# Altium project KPA_BDK2.PrjPcb
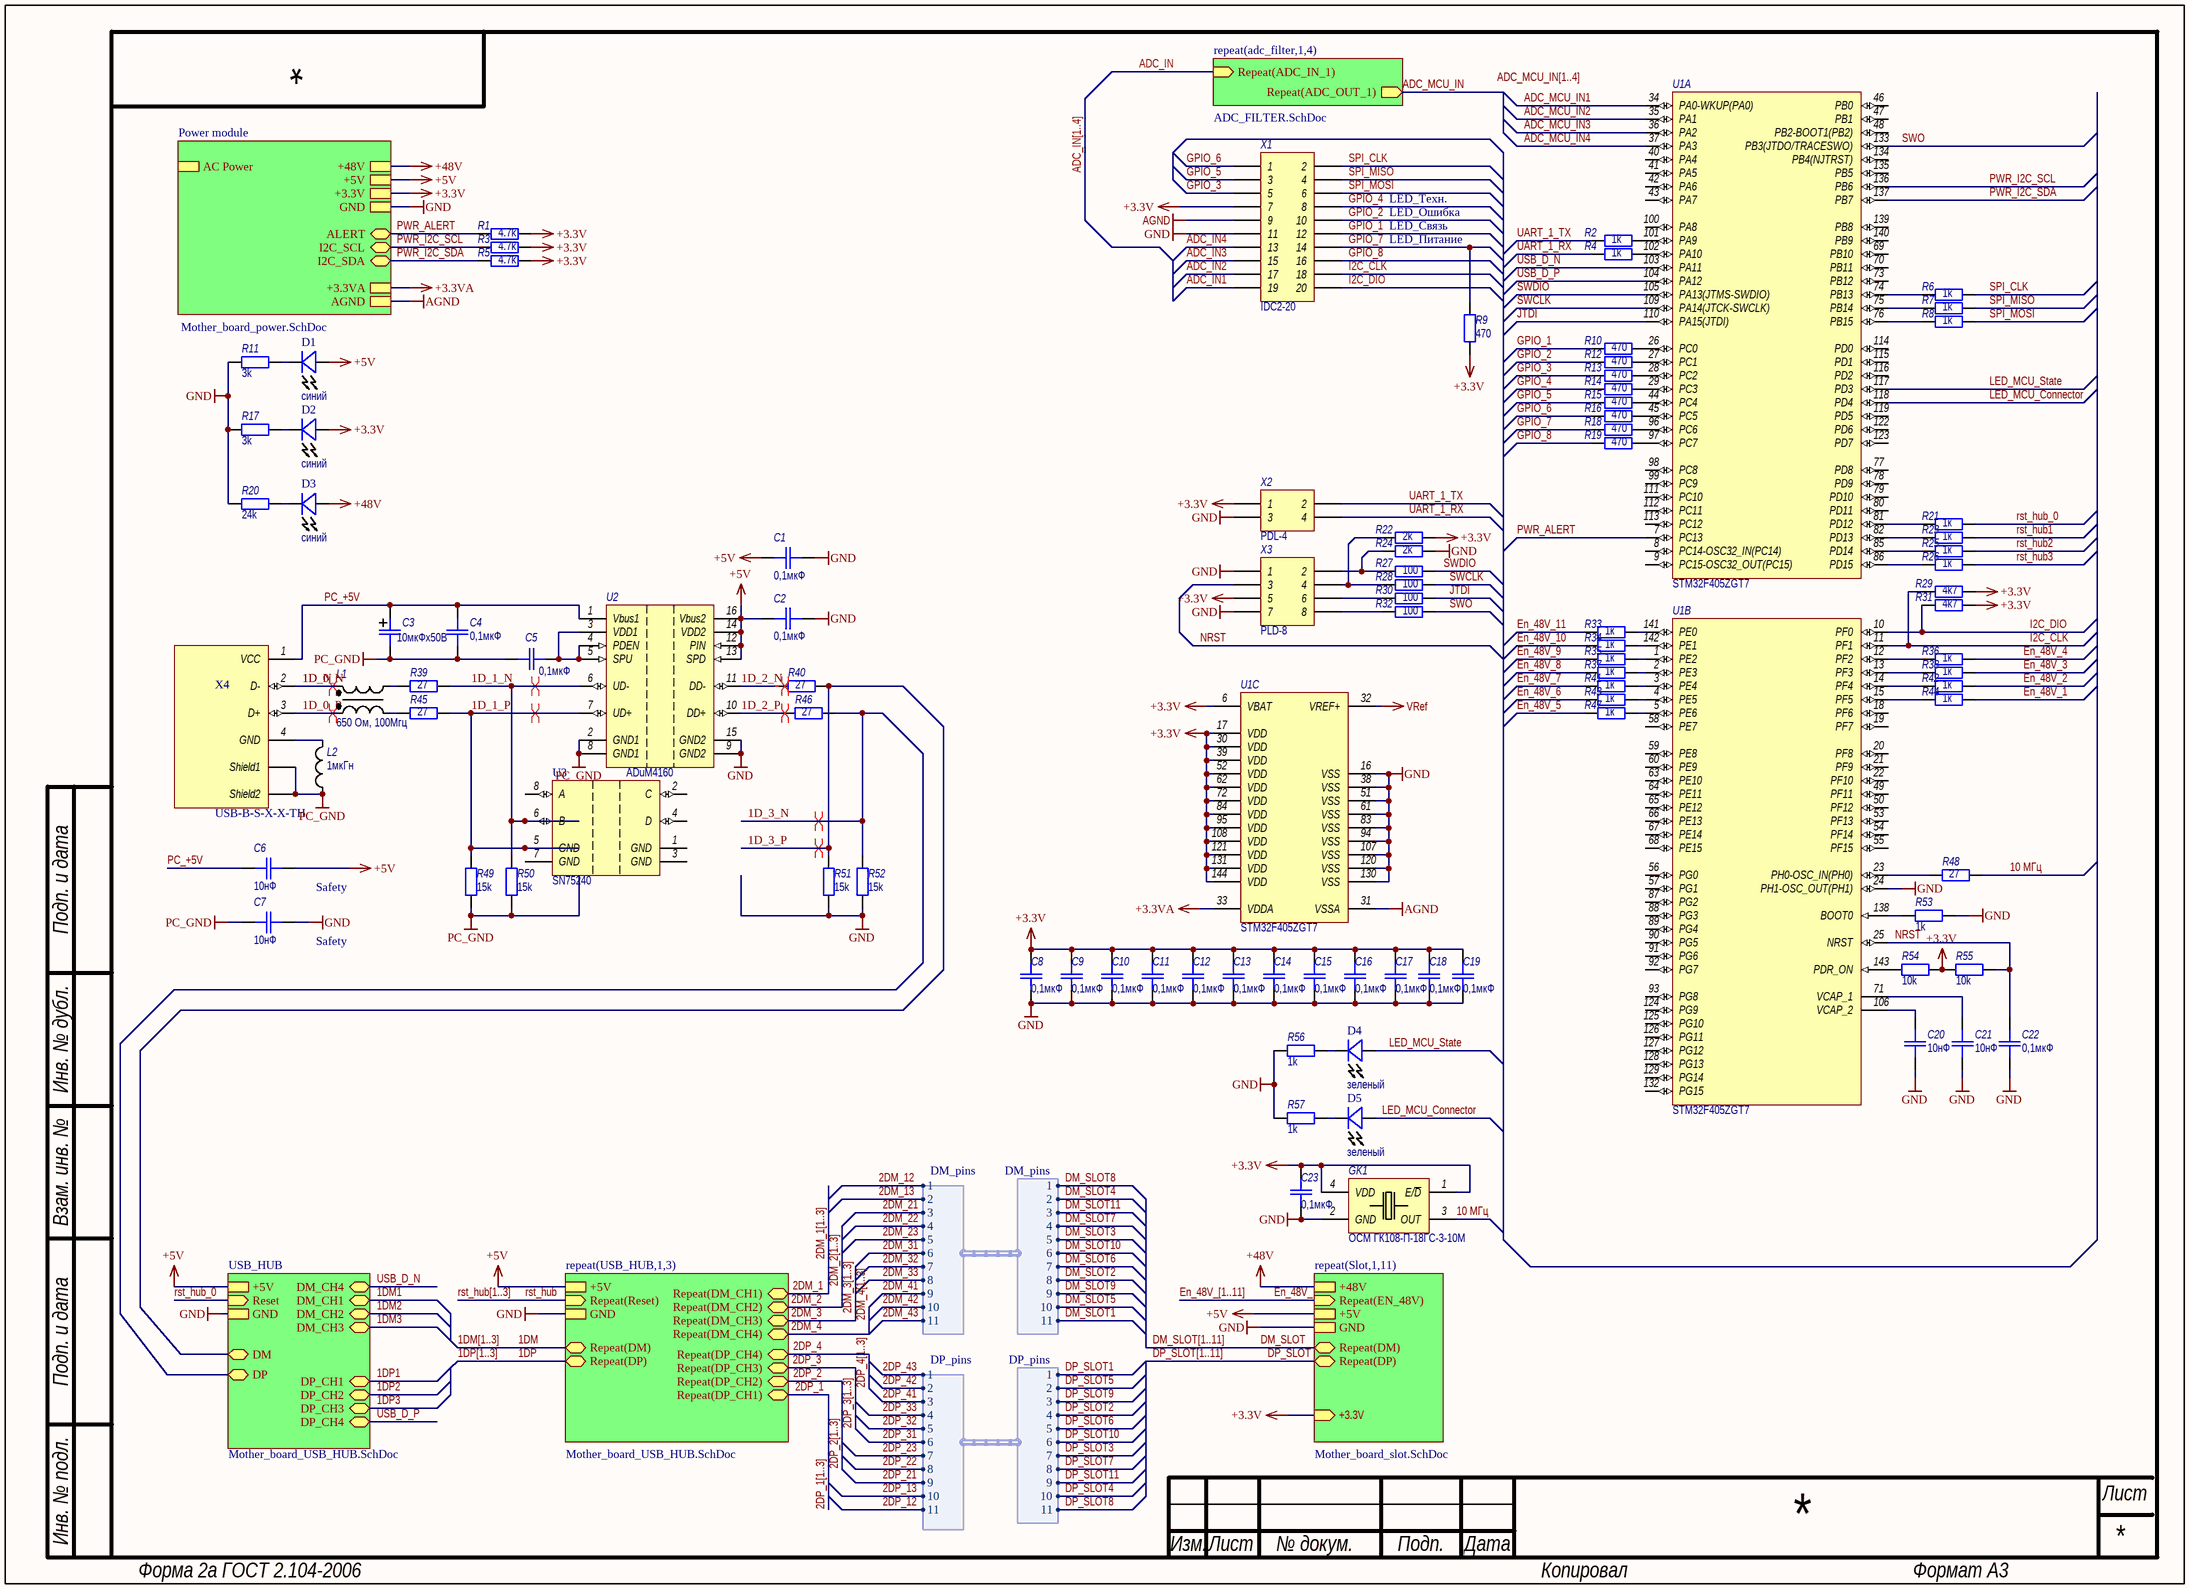
[diagram p0: Mother_board_main.SchDoc]
5 sheets, 354 parts. Net scope: hierarchical (ports join the sheet entries above them; power ports are global).
Board file: Mother_board.PcbDoc
Sheets:
  Mother_board_main.SchDoc
    Power module = Mother_board_power.SchDoc
    USB_HUB1 = Mother_board_USB_HUB.SchDoc
    USB_HUB2 = Mother_board_USB_HUB.SchDoc
    USB_HUB3 = Mother_board_USB_HUB.SchDoc
    Slot1 = Mother_board_slot.SchDoc
    Slot2 = Mother_board_slot.SchDoc
    Slot3 = Mother_board_slot.SchDoc
    Slot4 = Mother_board_slot.SchDoc
    Slot5 = Mother_board_slot.SchDoc
    Slot6 = Mother_board_slot.SchDoc
    Slot7 = Mother_board_slot.SchDoc
    Slot8 = Mother_board_slot.SchDoc
    Slot9 = Mother_board_slot.SchDoc
    Slot10 = Mother_board_slot.SchDoc
    Slot11 = Mother_board_slot.SchDoc
    USB_HUB = Mother_board_USB_HUB.SchDoc
    adc_filter1 = ADC_FILTER.SchDoc
    adc_filter2 = ADC_FILTER.SchDoc
    adc_filter3 = ADC_FILTER.SchDoc
    adc_filter4 = ADC_FILTER.SchDoc

## Sheet Mother_board_main.SchDoc
size 410 x 297 mm

### Parts
C1  0,1мкФ  [SMD_0805]
C2  0,1мкФ  [SMD_0805]
C3  10мкФх50В  [SMD_size_B]
C4  0,1мкФ  [SMD_0805]
C5  0,1мкФ  [SMD_0805]
C6  10нФ  [SMD_0805]
C7  10нФ  [SMD_0805]
C8  0,1мкФ  [SMD_0805]
C9  0,1мкФ  [SMD_0805]
C10  0,1мкФ  [SMD_0805]
C11  0,1мкФ  [SMD_0805]
C12  0,1мкФ  [SMD_0805]
C13  0,1мкФ  [SMD_0805]
C14  0,1мкФ  [SMD_0805]
C15  0,1мкФ  [SMD_0805]
C16  0,1мкФ  [SMD_0805]
C17  0,1мкФ  [SMD_0805]
C18  0,1мкФ  [SMD_0805]
C19  0,1мкФ  [SMD_0805]
C20  10нФ  [SMD_0805]
C21  10нФ  [SMD_0805]
C22  0,1мкФ  [SMD_0805]
C23  0,1мкФ  [SMD_0805]
D1  value синий  [LED-0805]  (hidden comment: LED)
D2  value синий  [LED-0805]  (hidden comment: LED)
D3  value синий  [LED-0805]  (hidden comment: LED)
D4  value зеленый  [LED-0805+circle]  (hidden comment: LED)
D5  value зеленый  [LED-0805+circle]  (hidden comment: LED)
GK1  Наименование: ОСМ ГК108-П-18ГС-3-10М  [SMD_7050_Crystal_Oscillator]  (hidden comment: GK108-P)
L1  650 Ом, 100Мгц  [ACM2012]
L2  1мкГн  [SMD_0805]
R1  4.7k  [SMD_0805]
R2  1k  [SMD_0805]
R3  4.7k  [SMD_0805]
R4  1k  [SMD_0805]
R5  4.7k  [SMD_0805]
R6  1k  [SMD_0805]
R7  1k  [SMD_0805]
R8  1k  [SMD_0805]
R9  470  [SMD_0805]
R10  470  [SMD_0805]
R11  3k  [SMD_0805]
R12  470  [SMD_0805]
R13  470  [SMD_0805]
R14  470  [SMD_0805]
R15  470  [SMD_0805]
R16  470  [SMD_0805]
R17  3k  [SMD_0805]
R18  470  [SMD_0805]
R19  470  [SMD_0805]
R20  24k  [SMD_0805]
R21  1к  [SMD_0805]
R22  2k  [SMD_0805]
R23  1к  [SMD_0805]
R24  2k  [SMD_0805]
R25  1к  [SMD_0805]
R26  1к  [SMD_0805]
R27  100  [SMD_0805]
R28  100  [SMD_0805]
R29  4k7  [SMD_0805]
R30  100  [SMD_0805]
R31  4k7  [SMD_0805]
R32  100  [SMD_0805]
R33  1к  [SMD_0805]
R34  1к  [SMD_0805]
R35  1к  [SMD_0805]
R36  1к  [SMD_0805]
R37  1к  [SMD_0805]
R38  1к  [SMD_0805]
R39  27  [SMD_0805]
R40  27  [SMD_0805]
R41  1к  [SMD_0805]
R42  1к  [SMD_0805]
R43  1к  [SMD_0805]
R44  1к  [SMD_0805]
R45  27  [SMD_0805]
R46  27  [SMD_0805]
R47  1к  [SMD_0805]
R48  27  [SMD_0805]
R49  15k  [SMD_0805]
R50  15k  [SMD_0805]
R51  15k  [SMD_0805]
R52  15k  [SMD_0805]
R53  1k  [SMD_0805]
R54  10k  [SMD_0805]
R55  10k  [SMD_0805]
R56  1k  [SMD_0805]
R57  1k  [SMD_0805]
U1  STM32F405ZGT7  [LQFP144]  (parts A,B,C of 3)
U2  ADuM1402  [SOIC-16-WIDE]  (value not drawn)
U3  SN75240  [SN75240]
X1  Наименование: IDC2-20  [PLD2-20]  (hidden comment: Header 2X20)
X2  Наименование: PDL-4  [PBD-4]  (hidden comment: Header 2X4)
X3  Наименование: PLD-8  [PBD-8]  (hidden comment: Header 2X8)
X4  USB-B-S-X-X-TH  [*SAMTEC_USB-B-S-X-X-TH_USB-B-S-X-X-TH(Primary)]

### Sub-sheets
Power module = Mother_board_power.SchDoc: AC Power (harness AC Power), I2C_SCL (bidir), I2C_SDA (bidir), ALERT (bidir), +5V, +48V, +3.3V, GND, +3.3VA, AGND
repeat(adc_filter,1,4) = ADC_FILTER.SchDoc: Repeat(ADC_OUT_1) (out), Repeat(ADC_IN_1) (in)
repeat(Slot,1,11) = Mother_board_slot.SchDoc: Repeat(DM) (bidir), Repeat(EN_48V) (in), Repeat(DP) (bidir), +48V, +5V, GND, +3.3V (in)
repeat(USB_HUB,1,3) = Mother_board_USB_HUB.SchDoc: Repeat(Reset) (in), Repeat(DP) (bidir), Repeat(DM) (bidir), Repeat(DP_CH1) (bidir), Repeat(DP_CH2) (bidir), Repeat(DP_CH3) (bidir), Repeat(DP_CH4) (bidir), Repeat(DM_CH1) (bidir), Repeat(DM_CH2) (bidir), Repeat(DM_CH3) (bidir), Repeat(DM_CH4) (bidir), +5V, GND
USB_HUB = Mother_board_USB_HUB.SchDoc: Reset (in), DP (bidir), DM (bidir), DP_CH1 (bidir), DP_CH2 (bidir), DP_CH3 (bidir), DP_CH4 (bidir), DM_CH1 (bidir), DM_CH2 (bidir), DM_CH3 (bidir), DM_CH4 (bidir), GND, +5V

### Harnesses
DM_pins: 1, 2, 3, 4, 5, 6, 7, 8, 9, 10, 11
DP_pins: 1, 2, 3, 4, 5, 6, 7, 8, 9, 10, 11

### Nets
+3.3V: C8.2 C9.2 C10.2 C11.2 C12.2 C13.2 C14.2 C15.2 C16.2 C17.2 C18.2 C19.2 C23.2 D2.1(A) GK1.1(E/~{D}) GK1.4(VDD) R1.1 R3.1 R5.1 R9.1 R22.2 R29.2 R31.2 R54.1 R55.2 U1.6(VBAT) U1.17(VDD) U1.30(VDD) U1.39(VDD) U1.52(VDD) U1.62(VDD) U1.72(VDD) U1.84(VDD) U1.95(VDD) U1.108(VDD) U1.121(VDD) U1.131(VDD) U1.144(VDD) X1.7 X2.1 X3.5 ; sheet Power module/+3.3V, sheet repeat(Slot,1,11)/+3.3V
+3.3VA: U1.33(VDDA) ; sheet Power module/+3.3VA
+5V: C1.2 C2.2 C6.2 D1.1(A) U2.12(PIN) U2.13(SPD) U2.14(VDD2) U2.16(Vbus2) ; sheet Power module/+5V, sheet repeat(USB_HUB,1,3)/+5V, sheet repeat(Slot,1,11)/+5V, sheet USB_HUB/+5V
+48V: D3.1(A) ; sheet Power module/+48V, sheet repeat(Slot,1,11)/+48V
AGND: U1.31(VSSA) X1.9 ; sheet Power module/AGND
GND: C1.1 C2.1 C7.2 C8.1 C9.1 C10.1 C11.1 C12.1 C13.1 C14.1 C15.1 C16.1 C17.1 C18.1 C19.1 C20.1 C21.1 C22.1 C23.1 GK1.2(GND) R11.1 R17.1 R20.1 R24.2 R51.2 R52.2 R53.1 R56.1 R57.1 U1.16(VSS) U1.24(PH1-OSC_OUT(PH1)) U1.38(VSS) U1.51(VSS) U1.61(VSS) U1.83(VSS) U1.94(VSS) U1.107(VSS) U1.120(VSS) U1.130(VSS) U2.9(GND2) U2.15(GND2) X1.11 X2.3 X3.1 X3.7 ; sheet Power module/GND, sheet repeat(USB_HUB,1,3)/GND, sheet repeat(Slot,1,11)/GND, sheet USB_HUB/GND
PC_GND: C3.2 C4.2 C5.1 C7.1 L2.1 R49.1 R50.1 U2.2(GND1) U2.8(GND1) X4.S1(Shield1) X4.S2(Shield2)
VRef: U1.32(VREF+)
1D_0_N: L1.2 X4.2(D-)  [also labelled 1D_N]
1D_0_P: L1.3 X4.3(D+)
1D_1_N: R39.2 R50.2 U2.6(UD-) U3.6(B)
1D_1_P: R45.2 R49.2 U2.7(UD+) U3.5(GND)
1D_2_N: R40.1 U2.11(DD-)
1D_2_P: R46.1 U2.10(DD+)
1D_3_N: R46.2 R52.1 ; sheet USB_HUB/DP
1D_3_P: R40.2 R51.1 ; sheet USB_HUB/DM
1DM: sheet repeat(USB_HUB,1,3)/Repeat(DM)
1DM3: sheet USB_HUB/DP_CH3, sheet USB_HUB/DM_CH3  [also labelled 1DP3]
1DP: sheet repeat(USB_HUB,1,3)/Repeat(DP)
2DM_1: sheet repeat(USB_HUB,1,3)/Repeat(DM_CH1)
2DM_2: sheet repeat(USB_HUB,1,3)/Repeat(DM_CH2)
2DM_3: sheet repeat(USB_HUB,1,3)/Repeat(DM_CH3)
2DM_4: sheet repeat(USB_HUB,1,3)/Repeat(DM_CH4)
2DM_31: harness DM_pins.6, harness DP_pins.6  [also labelled 2DP_31, DM_SLOT10, DP_SLOT10]  [project net 2D_8_N]
2DM_32: harness DM_pins.7, harness DP_pins.5  [also labelled 2DP_32, DM_SLOT6, DP_SLOT6]  [project net 2D_8_N]
2DM_33: harness DM_pins.8, harness DP_pins.4  [also labelled 2DP_33, DM_SLOT2, DP_SLOT2]  [project net 2D_8_N]
2DP_1: sheet repeat(USB_HUB,1,3)/Repeat(DP_CH1)
2DP_2: sheet repeat(USB_HUB,1,3)/Repeat(DP_CH2)
2DP_3: sheet repeat(USB_HUB,1,3)/Repeat(DP_CH3)
2DP_4: sheet repeat(USB_HUB,1,3)/Repeat(DP_CH4)
10 МГц: GK1.3(OUT) R48.1
ADC_IN: sheet repeat(adc_filter,1,4)/Repeat(ADC_IN_1)
ADC_IN1: X1.19
ADC_IN2: X1.17
ADC_IN3: X1.15
ADC_IN4: X1.13
ADC_MCU_IN: sheet repeat(adc_filter,1,4)/Repeat(ADC_OUT_1)
ADC_MCU_IN1: U1.34(PA0-WKUP(PA0))
ADC_MCU_IN2: U1.35(PA1)
ADC_MCU_IN3: U1.36(PA2)
ADC_MCU_IN4: U1.37(PA3)
DM_SLOT: sheet repeat(Slot,1,11)/Repeat(DM)
DP_SLOT: sheet repeat(Slot,1,11)/Repeat(DP)
En_48V_: sheet repeat(Slot,1,11)/Repeat(EN_48V)  [also labelled En_48V_[1..11]]
En_48V_1: R44.1  [also labelled En_48V_[1..11]1]
En_48V_2: R42.1  [also labelled En_48V_[1..11]2]
En_48V_3: R38.1  [also labelled En_48V_[1..11]3]
En_48V_4: R36.1  [also labelled En_48V_[1..11]4]
En_48V_5: R47.2  [also labelled En_48V_[1..11]5]
En_48V_6: R43.2  [also labelled En_48V_[1..11]6]
En_48V_7: R41.2  [also labelled En_48V_[1..11]7]
En_48V_8: R37.2  [also labelled En_48V_[1..11]8]
En_48V_9: R35.2  [also labelled En_48V_[1..11]9]
En_48V_10: R34.2  [also labelled En_48V_[1..11]10]
En_48V_11: R33.2  [also labelled En_48V_[1..11]11]
GPIO_1: R10.1 X1.12
GPIO_2: R12.1 X1.10
GPIO_3: R13.1 X1.5
GPIO_4: R14.1 X1.8
GPIO_5: R15.1 X1.3
GPIO_6: R16.1 X1.1
GPIO_7: R9.2 R18.1 X1.14
GPIO_8: R19.1 X1.16
I2C_CLK: R29.1 U1.11(PF1) X1.18
I2C_DIO: R31.1 U1.10(PF0) X1.20
JTDI: R30.2 U1.110(PA15(JTDI))
LED_MCU_Connector: D5.1(A) U1.118(PD4)
LED_MCU_State: D4.1(A) U1.117(PD3)
NRST: C22.2 R55.1 U1.25(NRST) X3.3
PC_+5V: C3.1 C4.1 C6.1 U2.1(Vbus1) X4.1(VCC)
PWR_ALERT: R1.2 U1.7(PC13) ; sheet Power module/ALERT
PWR_I2C_SCL: R3.2 U1.136(PB6) ; sheet Power module/I2C_SCL  [project net I2C_SCL]
PWR_I2C_SDA: R5.2 U1.137(PB7) ; sheet Power module/I2C_SDA  [project net I2C_SDA]
rst_hub: sheet repeat(USB_HUB,1,3)/Repeat(Reset)
rst_hub1: R23.1
rst_hub2: R25.1
rst_hub3: R26.1
rst_hub_0: R21.1 ; sheet USB_HUB/Reset
SPI_CLK: R6.2 X1.2
SPI_MISO: R7.2 X1.4
SPI_MOSI: R8.2 X1.6
SWCLK: R28.2 U1.109(PA14(JTCK-SWCLK))
SWDIO: R27.2 U1.105(PA13(JTMS-SWDIO))
SWO: R32.2 U1.133(PB3(JTDO/TRACESWO))
UART_1_RX: R4.1 X2.4
UART_1_TX: R2.1 X2.2
USB_D_N: U1.103(PA11) ; sheet USB_HUB/DM_CH4  [project net 2D_9_N]
USB_D_P: U1.104(PA12) ; sheet USB_HUB/DP_CH4  [project net 2D_9_P]
NetC5_2: C5.2 U2.3(VDD1) U2.4(PDEN) U2.5(SPU)
NetC20_2: C20.2 U1.106(VCAP_2)
NetC21_2: C21.2 U1.71(VCAP_1)
NetD1_2: D1.2(K) R11.2
NetD2_2: D2.2(K) R17.2
NetD3_2: D3.2(K) R20.2
NetD4_2: D4.2(K) R56.2
NetD5_2: D5.2(K) R57.2
NetL1_1: L1.1 R39.1
NetL1_4: L1.4 R45.1
NetL2_2: L2.2 X4.4(GND)
NetR2_2: R2.2 U1.101(PA9)
NetR4_2: R4.2 U1.102(PA10)
NetR6_1: R6.1 U1.74(PB13)
NetR7_1: R7.1 U1.75(PB14)
NetR8_1: R8.1 U1.76(PB15)
NetR10_2: R10.2 U1.26(PC0)
NetR12_2: R12.2 U1.27(PC1)
NetR13_2: R13.2 U1.28(PC2)
NetR14_2: R14.2 U1.29(PC3)
NetR15_2: R15.2 U1.44(PC4)
NetR16_2: R16.2 U1.45(PC5)
NetR18_2: R18.2 U1.96(PC6)
NetR19_2: R19.2 U1.97(PC7)
NetR21_2: R21.2 U1.81(PD12)
NetR22_1: R22.1 R28.1 X3.4
NetR23_2: R23.2 U1.82(PD13)
NetR24_1: R24.1 R27.1 X3.2
NetR25_2: R25.2 U1.85(PD14)
NetR26_2: R26.2 U1.86(PD15)
NetR30_1: R30.1 X3.6
NetR32_1: R32.1 X3.8
NetR33_1: R33.1 U1.141(PE0)
NetR34_1: R34.1 U1.142(PE1)
NetR35_1: R35.1 U1.1(PE2)
NetR36_2: R36.2 U1.12(PF2)
NetR37_1: R37.1 U1.2(PE3)
NetR38_2: R38.2 U1.13(PF3)
NetR41_1: R41.1 U1.3(PE4)
NetR42_2: R42.2 U1.14(PF4)
NetR43_1: R43.1 U1.4(PE5)
NetR44_2: R44.2 U1.15(PF5)
NetR47_1: R47.1 U1.5(PE6)
NetR48_2: R48.2 U1.23(PH0-OSC_IN(PH0))
NetR53_2: R53.2 U1.138(BOOT0)
NetR54_2: R54.2 U1.143(PDR_ON)

Not connected (* = marked no-connect by the designer): U1 8(PC14-OSC32_IN(PC14)) 9(PC15-OSC32_OUT(PC15)) 18(PF6) 19(PF7) 20(PF8) 21(PF9) 22(PF10) 40(PA4) 41(PA5) 42(PA6) 43(PA7) 46(PB0) 47(PB1) 48(PB2-BOOT1(PB2)) 49(PF11) 50(PF12) 53(PF13) 54(PF14) 55(PF15) 56(PG0) 57(PG1) 58(PE7) 59(PE8) 60(PE9) 63(PE10) 64(PE11) 65(PE12) 66(PE13) 67(PE14) 68(PE15) 69(PB10) 70(PB11) 73(PB12) 77(PD8) 78(PD9) 79(PD10) 80(PD11) 87(PG2) 88(PG3) 89(PG4) 90(PG5) 91(PG6) 92(PG7) 93(PG8) 98(PC8) 99(PC9) 100(PA8) 111(PC10) 112(PC11) 113(PC12) 114(PD0) 115(PD1) 116(PD2) 119(PD5) 122(PD6) 123(PD7) 124(PG9) 125(PG10) 126(PG11) 127(PG12) 128(PG13) 129(PG14) 132(PG15) 134(PB4(NJTRST)) 135(PB5) 139(PB8) 140(PB9); U3 1(GND) 2(C) 3(GND) 4(D) 7(GND) 8(A)

### Buses and harness runs
bus 1DM[1..3]
bus 1DP[1..3]
bus 2DM_1[1..3]
bus 2DM_2[1..3]
bus 2DM_3[1..3]
bus 2DM_4[1..3]
bus 2DP_1[1..3]
bus 2DP_2[1..3]
bus 2DP_3[1..3]
bus 2DP_4[1..3]
bus ADC_IN[1..4]
bus ADC_MCU_IN[1..4]
bus DM_SLOT[1..11]
bus DP_SLOT[1..11]
bus rst_hub[1..3]

### Layout directives
differential pair: 1D_0_N, 1D_0_P, 1D_1_N, 1D_1_P, 1D_2_N, 1D_2_P, 1D_3_N, 1D_3_P

### Notes on the sheet
- LED_Питание
- LED_Техн.
- LED_Связь
- LED_Ошибка
- Safety
- (near C7) Safety
- Labels drawn without touching a wire or pin: ADC_MCU_IN[1..4]
- Подп. и дата
- Инв. № дубл.
- Взам. инв. №
- Инв. № подл.
- Изм.
- Лист
- № докум.
- Подп.
- Дата
- Форма 2а ГОСТ 2.104-2006
- Копировал
- Формат А3

### Library data of the parts
C1 C2 C4-C23 = Capacitor: Назначение: SMD-конденсатор; Наименование: Конденсатор; Потребление, Вт: 0
  C1 C2 C4 C5 C8-C19 C22 C23: Value: 0,1мкФ
  C6 C7 C20 C21: Value: 10нФ
C3 = Capacitor_pol: Polarized capacitor; Назначение: Поляризованный SMD-конденсатор; Наименование: Поляризованный конденсатор; Потребление, Вт: 0; Value: 10мкФх50В
D1-D5 = LED: Назначение: Светодиод; Наименование: SMD-LED; Потребление, Вт: 0,01
GK1 = Crystal_Oscillator: Crystall oscillator, CMOS, 3.3V, SMD7050; Назначение: Кварцевый генератор; Потребление, Вт: 0,165; ComponentLink1Description: DataSheet; ComponentLink1URL: http://www.lit-phonon.ru/downloads/GK108-P.pdf
L1 = Inductor_coupled: Coupled inductor; Назначение: Связанная индуктивность; Наименование: PLT10HH1026R0PN; Потребление, Вт: 0,1; Value: 650 Ом, 100Мгц
L2 = Inductor: Наименование: Индуктивность; Назначение: SMD-индуктивность; Потребление, Вт: 0,010; Value: 1мкГн
R1-R57 = Resistor: Наименование: Резистор; Назначение: SMD-резистор; Потребление, Вт: 0,001
  R1 R3 R5: Value: 4.7k
  R2 R4 R6-R8 R53 R56 R57: Value: 1k
  R9 R10 R12-R16 R18 R19: Value: 470
  R11 R17: Value: 3k
  R20: Value: 24k
  R21 R23 R25 R26 R33-R38 R41-R44 R47: Value: 1к
  R22 R24: Value: 2k
  R27 R28 R30 R32: Value: 100
  R29 R31: Value: 4k7
  R39 R40 R45 R46 R48: Value: 27
  R49-R52: Value: 15k
  R54 R55: Value: 10k
U1 = STM32F405ZGT: ARM Cortex-M4 32-bit MCU+FPU, 210 DMIPS, 1024 kB Flash, 192 kB Internal RAM, 114 I/Os, 144-pin LQFP, -40 to 105 degC, Tray; Потребление, Вт: 0.2; Назначение: ARM Cortex-M4 32-bit MCU+FPU; ComponentLink1Description: Datasheet; ComponentLink1URL: http://www.st.com/st-web-ui/static/active/en/resource/technical/document/datasheet/DM00037051.pdf; DataSheet: https://www.st.com/content/ccc/resource/technical/document/reference_manual/3d/6d/5a/66/b4/99/40/d4/DM00031020.pdf/files/DM00031020.pdf/jcr:content/translations/en.DM00031020.pdf; HalManual: https://www.st.com/resource/en/user_manual/dm00105879-description-of-stm32f4-hal-and-ll-drivers-stmicroelectronics.pdf; Наименование: STM32F405ZGT7
U2 = ADuM4160: Quad Channel Digital Isolator, 2.5 KV rms Insulation Rating; Назначение: цифровой изолятор шины USB; Потребление, Вт: 0,025; DataSheet: https://www.analog.com/media/en/technical-documentation/data-sheets/ADuM4160.pdf; UserGuide: https://www.analog.com/media/en/reference-design-documentation/reference-designs/CN0160.pdf; Наименование: ADuM4160
U3 = SN75240: ESD-защита; Потребление, Вт: 0; Назначение: ESD-защита; Наименование: SN75240
X1 = Header 2X20: Header, 20-Pin, Dual row; Потребление, Вт: 0,0; Назначение: Header, 20-Pin, Dual row
X2 = Header 2X4: Header, 4-Pin, Dual row; Потребление, Вт: 0,0; Назначение: Header, 4-Pin, Dual row
X3 = Header 2X8: Header, 8-Pin, Dual row; Потребление, Вт: 0,0; Назначение: Header, 8-Pin, Dual row
X4 = USB-B-S-X-X-TH: USB-B (USB TYPE-B) USB 2.0 Receptacle Connector 4 Position Through Hole, Right Angle; MP: USB-B-S-F-B-TH; Потребление, Вт: 0; Назначение: USB соединитель; Availability: Bad; BuyPart: https://www.snapeda.com/parts/USB-B-S-F-B-TH/Samtec%20Inc./view-part/226211/?ref=eda; Toby_UK-Purchase-URL: https://snapeda.com/shop?store=Toby+UK&id=226211; SnapEDA_Link: https://www.snapeda.com/parts/USB-B-S-F-B-TH/Samtec%20Inc./view-part/226211/?ref=snap; Value: *; Наименование: USB-B

## Sheet Mother_board_power.SchDoc
size 209 x 297 mm; PageSetup: Record=PageOptions|CenterHorizontal=True|CenterVertical=True|PrintScale=1.00|XCorrection=1.00|YCorrection=1.00|PrintKind=1|BorderSize=5000000|LeftOffset=0|BottomOffset=0|Orientation=2|PaperLength=1000|PaperWidth=1000|Scale=100|PaperSource=15|PrintQuality=1200|MediaType=1|DitherType=10|PaperKind=A3|PrintScaleMode=1; Weight: -; ScaleFactor: -; NormInspection: Норм.Контр.
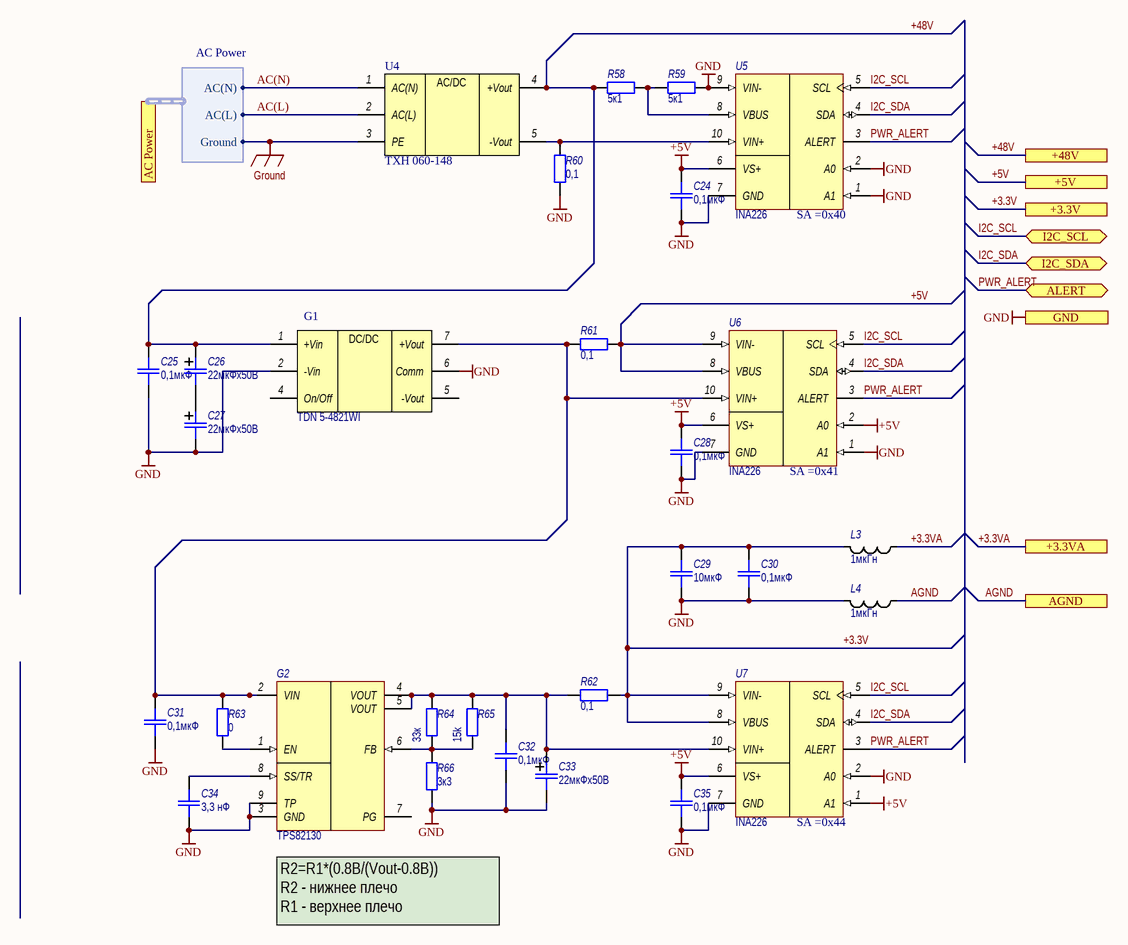
[diagram p1: Mother_board_power.SchDoc]

### Parts
C24  0,1мкФ  [SMD_0805]
C25  0,1мкФ  [SMD_0805]
C26  22мкФх50В  [SMD_size_B]
C27  22мкФх50В  [SMD_size_B]
C28  0,1мкФ  [SMD_0805]
C29  10мкФ  [SMD_0805]
C30  0,1мкФ  [SMD_0805]
C31  0,1мкФ  [SMD_0805]
C32  0,1мкФ  [SMD_0805]
C33  22мкФх50В  [SMD_size_B]
C34  3,3 нФ  [SMD_0805]
C35  0,1мкФ  [SMD_0805]
G1  Наименование: TDN 5-4821WI  [TDN_5_WISM]  (hidden comment: TDN 5-4821)
G2  TPS82130  [uSiL-8]
L3  1мкГн  [SMD_0805]
L4  1мкГн  [SMD_0805]
R58  5к1  [SMD_0805]
R59  5к1  [SMD_0805]
R60  0,1  [SMD_0805]
R61  0,1  [SMD_0805]
R62  0,1  [SMD_0805]
R63  0  [SMD_0805]
R64  33к  [SMD_0805]
R65  15k  [SMD_0805]
R66  3к3  [SMD_0805]
U4  TXH 060-148  [TXH 060-148 (2)]
U5  Adress: SA =0x40  [VSSOP-10]  (hidden comment: INA226)
U6  Adress: SA =0x41  [VSSOP-10]  (hidden comment: INA226)
U7  Adress: SA =0x44  [VSSOP-10]  (hidden comment: INA226)

### Ports
+3.3V, +3.3VA, +5V, +48V, AC Power (harness AC Power), AGND, ALERT (bidir), GND, I2C_SCL (bidir), I2C_SDA (bidir)

### Harnesses
AC Power: AC(N), AC(L), Ground

### Nets
+3.3V: C29.2 C30.2 L3.2 R62.2 U7.8(VBUS) U7.9(VIN-) ; port +3.3V
+3.3VA: L3.1 ; port +3.3VA
+5V: C24.2 C28.2 C35.2 R61.2 U5.6(VS+) U6.2(A0) U6.6(VS+) U6.8(VBUS) U6.9(VIN-) U7.1(A1) U7.6(VS+) ; port +5V
+48V: C25.2 C26.1 G1.1(+Vin) R58.1 U4.4(+Vout) ; port +48V
AGND: L4.1 ; port AGND
GND: C24.1 C25.1 C27.2 C28.1 C29.1 C30.1 C31.1 C32.1 C33.2 C34.1 C35.1 G1.2(-Vin) G1.6(Comm) G2.3(GND) G2.9(TP) L4.2 R59.2 R60.1 R66.2 U5.1(A1) U5.2(A0) U5.7(GND) U5.9(VIN-) U6.1(A1) U6.7(GND) U7.2(A0) U7.7(GND) ; port GND
Ground: U4.3(PE) ; port AC Power.Ground
AC(L): U4.2(AC(L)) ; port AC Power.AC(L)
AC(N): U4.1(AC(N)) ; port AC Power.AC(N)
I2C_SCL: U5.5(SCL) U6.5(SCL) U7.5(SCL) ; port I2C_SCL
I2C_SDA: U5.4(SDA) U6.4(SDA) U7.4(SDA) ; port I2C_SDA
PWR_ALERT: U5.3(ALERT) U6.3(ALERT) U7.3(ALERT) ; port ALERT
NetC26_2: C26.2 C27.1
NetC31_2: C31.2 G1.7(+Vout) G2.2(VIN) R61.1 R63.2 U6.10(VIN+)
NetC32_2: C32.2 C33.1 G2.4(VOUT) G2.5(VOUT) R62.1 R64.1 R65.1 U7.10(VIN+)
NetC34_2: C34.2 G2.8(SS/TR)
NetG2_1: G2.1(EN) R63.1
NetG2_6: G2.6(FB) R64.2 R65.2 R66.1
NetR58_2: R58.2 R59.1 U5.8(VBUS)
NetR60_2: R60.2 U4.5(-Vout) U5.10(VIN+)

Not connected (* = marked no-connect by the designer): G1 4(On/Off) 5(-Vout); G2 7(PG)

### Notes on the sheet
- (near G2) R2=R1*(0.8В/(Vout-0.8B))
  R2 - нижнее плечо
  R1 - верхнее плечо
- Перв. примен.
- Справ. №
- Подп. и дата
- Инв. № дубл.
- Взам. инв. №
- Разраб.
- Изм.
- Лист
- № докум.
- Подп.
- Дата
- Литера
- Масса
- Масштаб
- Пров.
- Т.контр.
- Листов
- Инв. № подл.
- Н.контр.
- Утв.
- Форма 1 ГОСТ 2.104-2006
- Копировал
- Формат А4
- (in symbol TEN5 2411) DC/DC
- (in symbol TXH 060-148) AC/DC

### Library data of the parts
C24 C25 C28-C32 C34 C35 = Capacitor: as C1 on sheet Mother_board_main
  C24 C25 C28 C30-C32 C35: Value: 0,1мкФ
  C29: Value: 10мкФ
  C34: Value: 3,3 нФ
C26 C27 C33 = Capacitor_pol: as C3 on sheet Mother_board_main; Value: 22мкФх50В
G1 = TEN5 2411: DC/DC converter; Назначение: DC-DC преобразователь; Потребление, Вт: 0,01; DataSheet: https://www.tracopower.com/sites/default/files/products/datasheets/tdn5wi_datasheet.pdf
G2 = TPS82130: 17-V Input 3-A Step-Down Converter MicroSiP™ Module with Integrated Inductor; Потребление, Вт: 1,0; ComponentLink1Description: Data sheet; ComponentLink1URL: http://www.ti.com/lit/ds/symlink/tps82130.pdf; Назначение: 17-V Input 3-A Step-Down Converter MicroSiP™ Module with Integrated Inductor; DataSheet: https://www.ti.com/lit/ds/symlink/tps82130.pdf?ts=1592813288219&ref_url=https%253A%252F%252Fwww.google.com%252F; Наименование: TPS82130
L3 L4 = Inductor: as L2 on sheet Mother_board_main; Value: 1мкГн
R58-R66 = Resistor: as R1 on sheet Mother_board_main
  R58 R59: Value: 5к1
  R60-R62: Value: 0,1
  R63: Value: 0
  R64: Value: 33к
  R65: Value: 15k
  R66: Value: 3к3
U4 = TXH 060-148: AC/DC Power Supply; Назначение: AC-DC преобразователь; Потребление, Вт: 60; Наименование: TXH 060-148
U5-U7 = INA226: High- or Low-Side Measurement, Bidirectional Current and Power Monitor With I2C Interface; Назначение: High-Side or Low-Side Measurement,; Потребление, Вт: 0,001; ComponentLink1Description: Data sheet; ComponentLink1URL: http://www.ti.com/lit/ds/symlink/ina226.pdf; DataSheet: https://www.ti.com/lit/ds/symlink/ina226.pdf?ts=1592809211957&ref_url=https%253A%252F%252Fwww.google.com%252F; Наименование: INA226

## Sheet Mother_board_USB_HUB.SchDoc
size 297 x 420 mm; PageSetup: Record=PageOptions|CenterHorizontal=True|CenterVertical=True|PrintScale=1.00|XCorrection=1.00|YCorrection=1.00|PrintKind=1|BorderSize=5000000|LeftOffset=0|BottomOffset=0|Orientation=2|PaperLength=1000|PaperWidth=1000|Scale=100|PaperSource=15|PrintQuality=1200|MediaType=1|DitherType=10|PaperKind=A3|PrintScaleMode=1; Weight: -; ScaleFactor: -; NormInspection: Норм.Контр.
Used 4 times, as channels USB_HUB1, USB_HUB2, USB_HUB3, USB_HUB. Parts and nets are listed once, with the designators drawn on the sheet.
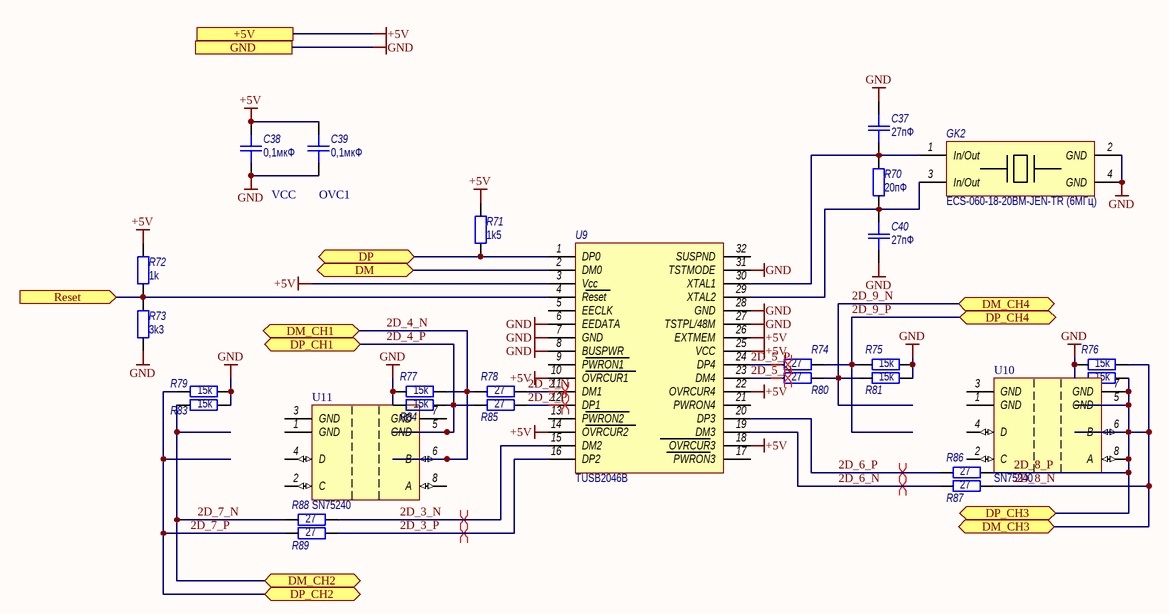
[diagram p2: Mother_board_USB_HUB.SchDoc]

### Parts
C37  27пФ  [SMD_0805]
C38  0,1мкФ  [SMD_0805]
C39  0,1мкФ  [SMD_0805]
C40  27пФ  [SMD_0805]
GK2  Наименование: ECS-060-18-20BM-JEN-TR (6МГц)  [SMD_7050_Crystal_Oscillator]
R70  20пФ  [SMD_0805]
R71  1k5  [SMD_0805]
R72  1k  [SMD_0805]
R73  3k3  [SMD_0805]
R74  27  [SMD_0805]
R75  15k  [SMD_0805]
R76  15k  [SMD_0805]
R77  15k  [SMD_0805]
R78  27  [SMD_0805]
R79  15k  [SMD_0805]
R80  27  [SMD_0805]
R81  15k  [SMD_0805]
R82  15k  [SMD_0805]
R83  15k  [SMD_0805]
R84  15k  [SMD_0805]
R85  27  [SMD_0805]
R86  27  [SMD_0805]
R87  27  [SMD_0805]
R88  27  [SMD_0805]
R89  27  [SMD_0805]
U9  TUSB2046B  [TUSB2046B]
U10  SN75240  [SN75240]
U11  SN75240  [SN75240]

### Ports
+5V, DM (bidir), DM_CH1 (bidir), DM_CH2 (bidir), DM_CH3 (bidir), DM_CH4 (bidir), DP (bidir), DP_CH1 (bidir), DP_CH2 (bidir), DP_CH3 (bidir), DP_CH4 (bidir), GND, Reset (in)

### Nets
+5V: C38.2 C39.2 R71.2 R72.2 U9.3(Vcc) U9.10(OVRCUR1) U9.14(OVRCUR2) U9.18(OVRCUR3) U9.22(OVRCUR4) U9.25(VCC) U9.26(EXTMEM) ; port +5V
GND: C37.2 C38.1 C39.1 C40.2 GK2.2(GND) GK2.4(GND) R73.1 R75.2 R76.1 R77.1 R79.2 R81.2 R82.1 R83.2 R84.1 U9.6(EEDATA) U9.7(GND) U9.8(BUSPWR) U9.27(TSTPL/48M) U9.28(GND) U9.31(TSTMODE) ; port GND
2D_2_N: R78.2 U9.11(DM1)
2D_2_P: R85.2 U9.12(DP1)
2D_3_N: R88.2 U9.15(DM2)
2D_3_P: R89.2 U9.16(DP2)
2D_4_N: R77.2 R78.1 U11.6(B) ; port DM_CH1
2D_4_P: R84.2 R85.1 U11.5(GND) ; port DP_CH1
2D_5_N: R80.1 U9.23(DM4)
2D_5_P: R74.1 U9.24(DP4)
2D_6_N: R87.1 U9.19(DM3)
2D_6_P: R86.1 U9.20(DP3)
2D_7_N: R83.1 R88.1 ; port DM_CH2
2D_7_P: R79.1 R89.1 ; port DP_CH2
2D_8_N: R76.2 R82.2 R86.2 R87.2 U10.5(GND) U10.6(B) U10.7(GND) U10.8(A) ; port DP_CH3, port DM_CH3  [also labelled 2D_8_P]
2D_9_N: R80.2 R81.1 ; port DM_CH4
2D_9_P: R74.2 R75.1 ; port DP_CH4
DM: U9.2(DM0) ; port DM
DP: R71.1 U9.1(DP0) ; port DP
Reset: R72.1 R73.2 U9.4(Reset) ; port Reset
NetC37_1: C37.1 GK2.1(In/Out) R70.1 U9.30(XTAL1)
NetC40_1: C40.1 GK2.3(In/Out) R70.2 U9.29(XTAL2)

Not connected (* = marked no-connect by the designer): U9 5(EECLK) 9(PWRON1) 13(PWRON2) 17(PWRON3) 21(PWRON4) 32(SUSPND); U10 1(GND) 2(C) 3(GND) 4(D); U11 1(GND) 2(C) 3(GND) 4(D) 7(GND) 8(A)

### Channels
USB_HUB1: designators end in _USB_HUB1; ports +5V=+5V DM=1DM1 DM_CH1=2D_4_N_USB_HUB1 DM_CH2=2D_7_N DM_CH3=2D_8_N DM_CH4=2D_9_N DP=1DP1 DP_CH1=2D_4_P_USB_HUB1 DP_CH2=2D_7_P DP_CH3=2D_8_N DP_CH4=2D_9_P GND=GND Reset=rst_hub1
USB_HUB2: designators end in _USB_HUB2; ports +5V=+5V DM=1DM2 DM_CH1=2D_4_N DM_CH2=2D_7_N DM_CH3=2D_8_N DM_CH4=2D_9_N DP=1DP2 DP_CH1=2D_4_P DP_CH2=2D_7_P DP_CH3=2D_8_N DP_CH4=2D_9_P GND=GND Reset=rst_hub2
USB_HUB3: designators end in _USB_HUB3; ports +5V=+5V DM=1DM3 DM_CH1=2D_4_N DM_CH2=2D_7_N DM_CH3=2D_8_N DM_CH4=2D_9_N DP=1DM3 DP_CH1=2D_4_P DP_CH2=2D_7_P DP_CH3=2D_8_N DP_CH4=2D_9_P GND=GND Reset=rst_hub3
USB_HUB: designators end in _USB_HUB; ports +5V=+5V DM=1D_3_P DM_CH1=1DM1 DM_CH2=1DM2 DM_CH3=1DM3 DM_CH4=2D_9_N DP=1D_3_N DP_CH1=1DP1 DP_CH2=1DP2 DP_CH3=1DM3 DP_CH4=2D_9_P GND=GND Reset=rst_hub_0

### Layout directives
differential pair: 2D_2_N_USB_HUB1, 2D_2_P_USB_HUB1, 2D_3_N_USB_HUB1, 2D_3_P_USB_HUB1, 2D_5_N_USB_HUB1, 2D_5_P_USB_HUB1, 2D_6_N_USB_HUB1, 2D_6_P_USB_HUB1

### Notes on the sheet
- VCC
- (near C39) OVC1
- Перв. примен.
- Справ. №
- Подп. и дата
- Инв. № дубл.
- Взам. инв. №
- Разраб.
- Изм.
- Лист
- № докум.
- Подп.
- Дата
- Литера
- Масса
- Масштаб
- Пров.
- Т.контр.
- Листов
- Инв. № подл.
- Н.контр.
- Утв.
- Форма 1 ГОСТ 2.104-2006
- Копировал
- Формат А3

### Library data of the parts
C37-C40 = Capacitor: as C1 on sheet Mother_board_main
  C37 C40: Value: 27пФ
  C38 C39: Value: 0,1мкФ
GK2 = Crystal: Crystall; Назначение: Кварцевый генератор; Потребление, Вт: 0,165; ComponentLink1Description: DataSheet; ComponentLink1URL: http://www.lit-phonon.ru/downloads/GK108-P.pdf
R70-R89 = Resistor: as R1 on sheet Mother_board_main
  R70: Value: 20пФ
  R71: Value: 1k5
  R72: Value: 1k
  R73: Value: 3k3
  R74 R78 R80 R85-R89: Value: 27
  R75-R77 R79 R81-R84: Value: 15k
U9 = TUSB2046B: TUSB2046x 4-Port USB-концентратор; Потребление, Вт: 0,165; Назначение: USB-концентратор; ComponentLink1Description: DataSheet; ComponentLink1URL: http://www.lit-phonon.ru/downloads/GK108-P.pdf; Наименование: TUSB2046B
U10 U11 = SN75240: ESD-защита; Потребление, Вт: 0; Назначение: ESD-защита; Наименование: SN75240

## Sheet Mother_board_slot.SchDoc
size 209 x 297 mm; PageSetup: Record=PageOptions|CenterHorizontal=True|CenterVertical=True|PrintScale=1.00|XCorrection=1.00|YCorrection=1.00|PrintKind=1|BorderSize=5000000|LeftOffset=0|BottomOffset=0|Orientation=2|PaperLength=1000|PaperWidth=1000|Scale=100|PaperSource=15|PrintQuality=1200|MediaType=1|DitherType=10|PaperKind=A3|PrintScaleMode=1; Weight: -; ScaleFactor: -; NormInspection: Норм.Контр.
Used 11 times, as channels Slot1, Slot2, Slot3, Slot4, Slot5, Slot6, Slot7, Slot8, Slot9, Slot10, Slot11. Parts and nets are listed once, with the designators drawn on the sheet.
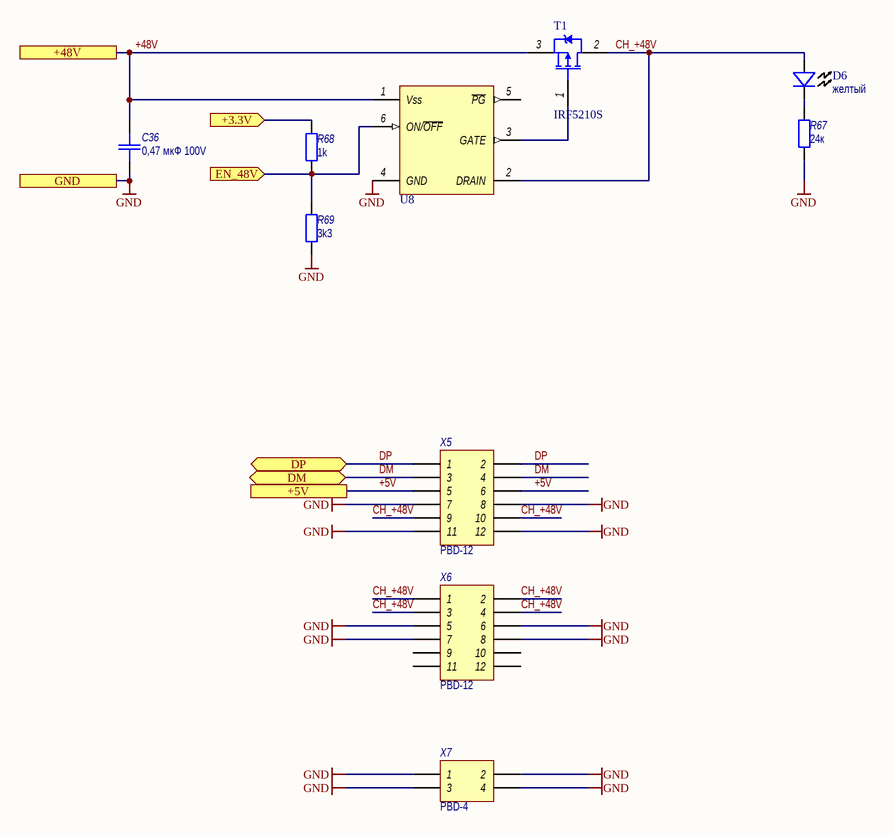
[diagram p3: Mother_board_slot.SchDoc]

### Parts
C36  0,47 мкФ 100V  [SMD_0805]
D6  value желтый  [LED-0805]  (hidden comment: LED)
R67  24к  [SMD_0805]
R68  1k  [SMD_0805]
R69  3k3  [SMD_0805]
T1  IRF5210S  [D2Pak]
U8  MAX5902  [SOT23-6]  (value not drawn)
X5  Header 2X12  [PBD-12]  (value not drawn)
X6  Header 2X12  [PBD-12]  (value not drawn)
X7  Header 2X4  [PBD-4]  (value not drawn)

### Ports
+3.3V (in), +5V, +48V, DM (bidir), DP (bidir), EN_48V (in), GND

### Nets
GND: C36.1 R67.1 R69.1 U8.4(GND) X5.7 X5.8 X5.11 X5.12 X6.5 X6.6 X6.7 X6.8 X7.1 X7.2 X7.3 X7.4 ; port GND
+3.3V: R68.1 ; port +3.3V
+5V: X5.5 X5.6 ; port +5V
+48V: C36.2 T1.3(S) U8.1(Vss) ; port +48V
CH_+48V: D6.1(A) T1.2(D) U8.2(DRAIN) X5.9 X5.10 X6.1 X6.2 X6.3 X6.4
DM: X5.3 X5.4 ; port DM
DP: X5.1 X5.2 ; port DP
EN_48V: R68.2 R69.2 U8.6(ON/~{OFF}) ; port EN_48V
NetD6_2: D6.2(K) R67.2
NetT1_1: T1.1(G) U8.3(GATE)

Not connected (* = marked no-connect by the designer): U8 5(~{PG}); X6 9 10 11 12

### Channels
Slot1: designators end in _Slot1; ports +3.3V=+3.3V +5V=+5V +48V=+48V DM=2D_9_N DP=2D_9_P EN_48V=En_48V_1 GND=GND
Slot2: designators end in _Slot2; ports +3.3V=+3.3V +5V=+5V +48V=+48V DM=2D_8_N DP=2D_8_N EN_48V=En_48V_2 GND=GND
Slot3: designators end in _Slot3; ports +3.3V=+3.3V +5V=+5V +48V=+48V DM=2D_7_N DP=2D_7_P EN_48V=En_48V_3 GND=GND
Slot4: designators end in _Slot4; ports +3.3V=+3.3V +5V=+5V +48V=+48V DM=2D_4_N DP=2D_4_P EN_48V=En_48V_4 GND=GND
Slot5: designators end in _Slot5; ports +3.3V=+3.3V +5V=+5V +48V=+48V DM=2D_9_N DP=2D_9_P EN_48V=En_48V_5 GND=GND
Slot6: designators end in _Slot6; ports +3.3V=+3.3V +5V=+5V +48V=+48V DM=2D_8_N DP=2D_8_N EN_48V=En_48V_6 GND=GND
Slot7: designators end in _Slot7; ports +3.3V=+3.3V +5V=+5V +48V=+48V DM=2D_7_N DP=2D_7_P EN_48V=En_48V_7 GND=GND
Slot8: designators end in _Slot8; ports +3.3V=+3.3V +5V=+5V +48V=+48V DM=2D_4_N DP=2D_4_P EN_48V=En_48V_8 GND=GND
Slot9: designators end in _Slot9; ports +3.3V=+3.3V +5V=+5V +48V=+48V DM=2D_9_N DP=2D_9_P EN_48V=En_48V_9 GND=GND
Slot10: designators end in _Slot10; ports +3.3V=+3.3V +5V=+5V +48V=+48V DM=2D_8_N DP=2D_8_N EN_48V=En_48V_10 GND=GND
Slot11: designators end in _Slot11; ports +3.3V=+3.3V +5V=+5V +48V=+48V DM=2D_7_N DP=2D_7_P EN_48V=En_48V_11 GND=GND

### Notes on the sheet
- Перв. примен.
- Справ. №
- Подп. и дата
- Инв. № дубл.
- Взам. инв. №
- Разраб.
- Изм.
- Лист
- № докум.
- Подп.
- Дата
- Литера
- Масса
- Масштаб
- Пров.
- Т.контр.
- Листов
- Инв. № подл.
- Н.контр.
- Утв.
- Форма 1 ГОСТ 2.104-2006
- Копировал
- Формат А4

### Library data of the parts
C36 = Capacitor: as C1 on sheet Mother_board_main; Value: 0,47 мкФ 100V
D6 = LED: as D1 on sheet Mother_board_main
R67-R69 = Resistor: as R1 on sheet Mother_board_main
  R67: Value: 24к
  R68: Value: 1k
  R69: Value: 3k3
T1 = IRF5210S: P channel Power MosFET; Назначение: Транзистор P канальный; Потребление, Вт: 0,02; Наименование: IRF5210S
U8 = MAX5902: Hot-swap controller; Package Information: Latest Revision: ver11.0, Feb-2003; Configures: APEX II, APEX 20K, Mercury, ACEX 1K & FLEX Devices; Code - JEDEC: MS-026-ABA; Назначение: Драйвер верхнего плеча, драйвер P транзистора; Потребление, Вт: 0,01; Published: 17-Sep-2003; Datasheet: Latest Revision: ver1.1, Oct-2003; Package Reference: TQFP32; Publisher: Altium Limited; Наименование: MAX5902
X5 X6 = Header 2X12: Header, 12-Pin, Dual row; Потребление, Вт: 0,0; Назначение: Header, 12-Pin, Dual row; Наименование: PBD-12
X7 = Header 2X4: as X2 on sheet Mother_board_main; Назначение: Header, 4-Pin, Dual row; Наименование: PBD-4

## Sheet ADC_FILTER.SchDoc
size 209 x 297 mm
Used 4 times, as channels adc_filter1, adc_filter2, adc_filter3, adc_filter4. Parts and nets are listed once, with the designators drawn on the sheet.
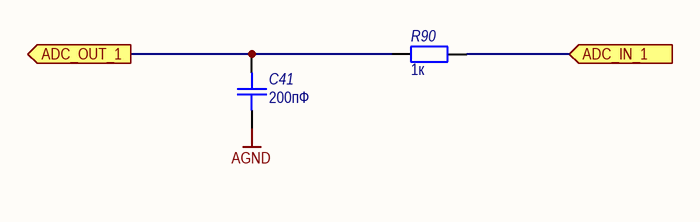
[diagram p4: ADC_FILTER.SchDoc]

### Parts
C41  200пФ  [SMD_0805]
R90  1к  [SMD_0805]

### Ports
ADC_IN_1 (in), ADC_OUT_1 (out)

### Nets
AGND: C41.1
ADC_IN_1: R90.2 ; port ADC_IN_1
ADC_OUT_1: C41.2 R90.1 ; port ADC_OUT_1

### Channels
adc_filter1: designators end in _adc_filter1; ports ADC_IN_1=ADC_IN1 ADC_OUT_1=ADC_MCU_IN1
adc_filter2: designators end in _adc_filter2; ports ADC_IN_1=ADC_IN2 ADC_OUT_1=ADC_MCU_IN2
adc_filter3: designators end in _adc_filter3; ports ADC_IN_1=ADC_IN3 ADC_OUT_1=ADC_MCU_IN3
adc_filter4: designators end in _adc_filter4; ports ADC_IN_1=ADC_IN4 ADC_OUT_1=ADC_MCU_IN4

### Notes on the sheet
- Подп. и дата
- Инв. № дубл.
- Взам. инв. №
- Инв. № подл.
- Изм.
- Лист
- № докум.
- Подп.
- Дата
- Форма 2а ГОСТ 2.104-2006
- Копировал
- Формат А4

### Library data of the parts
C41 = Capacitor: Назначение: SMD-конденсатор; Наименование: Конденсатор; Потребление, Вт: 0; Value: 0,1мкФ
R90 = Resistor: as R1 on sheet Mother_board_main; Value: 1к

## Nets that join several sheets
+3.3V: Mother_board_main (41 pins), Mother_board_power (6 pins), Slot1 (R68_Slot1.1), Slot2 (R68_Slot2.1), Slot3 (R68_Slot3.1), Slot4 (R68_Slot4.1), Slot5 (R68_Slot5.1), Slot6 (R68_Slot6.1), Slot7 (R68_Slot7.1), Slot8 (R68_Slot8.1), Slot9 (R68_Slot9.1), Slot10 (R68_Slot10.1), Slot11 (R68_Slot11.1)
+3.3VA: Mother_board_main (U1.33), Mother_board_power (L3.1)
+5V: Mother_board_main (8 pins), Mother_board_power (11 pins), USB_HUB1 (11 pins), USB_HUB2 (11 pins), USB_HUB3 (11 pins), Slot1 (X5_Slot1.5 X5_Slot1.6), Slot2 (X5_Slot2.5 X5_Slot2.6), Slot3 (X5_Slot3.5 X5_Slot3.6), Slot4 (X5_Slot4.5 X5_Slot4.6), Slot5 (X5_Slot5.5 X5_Slot5.6), Slot6 (X5_Slot6.5 X5_Slot6.6), Slot7 (X5_Slot7.5 X5_Slot7.6), Slot8 (X5_Slot8.5 X5_Slot8.6), Slot9 (X5_Slot9.5 X5_Slot9.6), Slot10 (X5_Slot10.5 X5_Slot10.6), Slot11 (X5_Slot11.5 X5_Slot11.6), USB_HUB (11 pins)
+48V: Mother_board_main (D3.1), Mother_board_power (5 pins), Slot1 (C36_Slot1.2 T1_Slot1.3 U8_Slot1.1), Slot2 (C36_Slot2.2 T1_Slot2.3 U8_Slot2.1), Slot3 (C36_Slot3.2 T1_Slot3.3 U8_Slot3.1), Slot4 (C36_Slot4.2 T1_Slot4.3 U8_Slot4.1), Slot5 (C36_Slot5.2 T1_Slot5.3 U8_Slot5.1), Slot6 (C36_Slot6.2 T1_Slot6.3 U8_Slot6.1), Slot7 (C36_Slot7.2 T1_Slot7.3 U8_Slot7.1), Slot8 (C36_Slot8.2 T1_Slot8.3 U8_Slot8.1), Slot9 (C36_Slot9.2 T1_Slot9.3 U8_Slot9.1), Slot10 (C36_Slot10.2 T1_Slot10.3 U8_Slot10.1), Slot11 (C36_Slot11.2 T1_Slot11.3 U8_Slot11.1)
AGND: Mother_board_main (U1.31 X1.9), Mother_board_power (L4.1), adc_filter1 (C41_adc_filter1.1), adc_filter2 (C41_adc_filter2.1), adc_filter3 (C41_adc_filter3.1), adc_filter4 (C41_adc_filter4.1)
GND: Mother_board_main (45 pins), Mother_board_power (27 pins), USB_HUB1 (21 pins), USB_HUB2 (21 pins), USB_HUB3 (21 pins), Slot1 (16 pins), Slot2 (16 pins), Slot3 (16 pins), Slot4 (16 pins), Slot5 (16 pins), Slot6 (16 pins), Slot7 (16 pins), Slot8 (16 pins), Slot9 (16 pins), Slot10 (16 pins), Slot11 (16 pins), USB_HUB (21 pins)
1D_3_N: Mother_board_main (R46.2 R52.1), USB_HUB (R71_USB_HUB.1 U9_USB_HUB.1)
1D_3_P: Mother_board_main (R40.2 R51.1), USB_HUB (U9_USB_HUB.2)
1DM1: USB_HUB1 (U9_USB_HUB1.2), USB_HUB (R77_USB_HUB.2 R78_USB_HUB.1 U11_USB_HUB.6)
1DM2: USB_HUB2 (U9_USB_HUB2.2), USB_HUB (R83_USB_HUB.1 R88_USB_HUB.1)
1DM3: USB_HUB3 (R71_USB_HUB3.1 U9_USB_HUB3.1 U9_USB_HUB3.2), USB_HUB (8 pins)
1DP1: USB_HUB1 (R71_USB_HUB1.1 U9_USB_HUB1.1), USB_HUB (R84_USB_HUB.2 R85_USB_HUB.1 U11_USB_HUB.5)
1DP2: USB_HUB2 (R71_USB_HUB2.1 U9_USB_HUB2.1), USB_HUB (R79_USB_HUB.1 R89_USB_HUB.1)
2D_4_N: USB_HUB2 (R77_USB_HUB2.2 R78_USB_HUB2.1 U11_USB_HUB2.6), Slot8 (X5_Slot8.3 X5_Slot8.4)
2D_4_N: USB_HUB3 (R77_USB_HUB3.2 R78_USB_HUB3.1 U11_USB_HUB3.6), Slot4 (X5_Slot4.3 X5_Slot4.4)
2D_4_P: USB_HUB2 (R84_USB_HUB2.2 R85_USB_HUB2.1 U11_USB_HUB2.5), Slot8 (X5_Slot8.1 X5_Slot8.2)
2D_4_P: USB_HUB3 (R84_USB_HUB3.2 R85_USB_HUB3.1 U11_USB_HUB3.5), Slot4 (X5_Slot4.1 X5_Slot4.2)
2D_7_N: USB_HUB1 (R83_USB_HUB1.1 R88_USB_HUB1.1), Slot11 (X5_Slot11.3 X5_Slot11.4)
2D_7_N: USB_HUB2 (R83_USB_HUB2.1 R88_USB_HUB2.1), Slot7 (X5_Slot7.3 X5_Slot7.4)
2D_7_N: USB_HUB3 (R83_USB_HUB3.1 R88_USB_HUB3.1), Slot3 (X5_Slot3.3 X5_Slot3.4)
2D_7_P: USB_HUB1 (R79_USB_HUB1.1 R89_USB_HUB1.1), Slot11 (X5_Slot11.1 X5_Slot11.2)
2D_7_P: USB_HUB2 (R79_USB_HUB2.1 R89_USB_HUB2.1), Slot7 (X5_Slot7.1 X5_Slot7.2)
2D_7_P: USB_HUB3 (R79_USB_HUB3.1 R89_USB_HUB3.1), Slot3 (X5_Slot3.1 X5_Slot3.2)
2D_8_N: USB_HUB1 (8 pins), Slot10 (X5_Slot10.1 X5_Slot10.2 X5_Slot10.3 X5_Slot10.4)
2D_8_N: USB_HUB2 (8 pins), Slot6 (X5_Slot6.1 X5_Slot6.2 X5_Slot6.3 X5_Slot6.4)
2D_8_N: USB_HUB3 (8 pins), Slot2 (X5_Slot2.1 X5_Slot2.2 X5_Slot2.3 X5_Slot2.4)
2D_9_N: Mother_board_main (U1.103), USB_HUB (R80_USB_HUB.2 R81_USB_HUB.1)
2D_9_N: USB_HUB1 (R80_USB_HUB1.2 R81_USB_HUB1.1), Slot9 (X5_Slot9.3 X5_Slot9.4)
2D_9_N: USB_HUB2 (R80_USB_HUB2.2 R81_USB_HUB2.1), Slot5 (X5_Slot5.3 X5_Slot5.4)
2D_9_N: USB_HUB3 (R80_USB_HUB3.2 R81_USB_HUB3.1), Slot1 (X5_Slot1.3 X5_Slot1.4)
2D_9_P: Mother_board_main (U1.104), USB_HUB (R74_USB_HUB.2 R75_USB_HUB.1)
2D_9_P: USB_HUB1 (R74_USB_HUB1.2 R75_USB_HUB1.1), Slot9 (X5_Slot9.1 X5_Slot9.2)
2D_9_P: USB_HUB2 (R74_USB_HUB2.2 R75_USB_HUB2.1), Slot5 (X5_Slot5.1 X5_Slot5.2)
2D_9_P: USB_HUB3 (R74_USB_HUB3.2 R75_USB_HUB3.1), Slot1 (X5_Slot1.1 X5_Slot1.2)
ADC_IN1: Mother_board_main (X1.19), adc_filter1 (R90_adc_filter1.2)
ADC_IN2: Mother_board_main (X1.17), adc_filter2 (R90_adc_filter2.2)
ADC_IN3: Mother_board_main (X1.15), adc_filter3 (R90_adc_filter3.2)
ADC_IN4: Mother_board_main (X1.13), adc_filter4 (R90_adc_filter4.2)
ADC_MCU_IN1: Mother_board_main (U1.34), adc_filter1 (C41_adc_filter1.2 R90_adc_filter1.1)
ADC_MCU_IN2: Mother_board_main (U1.35), adc_filter2 (C41_adc_filter2.2 R90_adc_filter2.1)
ADC_MCU_IN3: Mother_board_main (U1.36), adc_filter3 (C41_adc_filter3.2 R90_adc_filter3.1)
ADC_MCU_IN4: Mother_board_main (U1.37), adc_filter4 (C41_adc_filter4.2 R90_adc_filter4.1)
En_48V_1: Mother_board_main (R44.1), Slot1 (R68_Slot1.2 R69_Slot1.2 U8_Slot1.6)
En_48V_2: Mother_board_main (R42.1), Slot2 (R68_Slot2.2 R69_Slot2.2 U8_Slot2.6)
En_48V_3: Mother_board_main (R38.1), Slot3 (R68_Slot3.2 R69_Slot3.2 U8_Slot3.6)
En_48V_4: Mother_board_main (R36.1), Slot4 (R68_Slot4.2 R69_Slot4.2 U8_Slot4.6)
En_48V_5: Mother_board_main (R47.2), Slot5 (R68_Slot5.2 R69_Slot5.2 U8_Slot5.6)
En_48V_6: Mother_board_main (R43.2), Slot6 (R68_Slot6.2 R69_Slot6.2 U8_Slot6.6)
En_48V_7: Mother_board_main (R41.2), Slot7 (R68_Slot7.2 R69_Slot7.2 U8_Slot7.6)
En_48V_8: Mother_board_main (R37.2), Slot8 (R68_Slot8.2 R69_Slot8.2 U8_Slot8.6)
En_48V_9: Mother_board_main (R35.2), Slot9 (R68_Slot9.2 R69_Slot9.2 U8_Slot9.6)
En_48V_10: Mother_board_main (R34.2), Slot10 (R68_Slot10.2 R69_Slot10.2 U8_Slot10.6)
En_48V_11: Mother_board_main (R33.2), Slot11 (R68_Slot11.2 R69_Slot11.2 U8_Slot11.6)
I2C_SCL: Mother_board_main (R3.2 U1.136), Mother_board_power (U5.5 U6.5 U7.5)
I2C_SDA: Mother_board_main (R5.2 U1.137), Mother_board_power (U5.4 U6.4 U7.4)
PWR_ALERT: Mother_board_main (R1.2 U1.7), Mother_board_power (U5.3 U6.3 U7.3)
rst_hub1: Mother_board_main (R23.1), USB_HUB1 (R72_USB_HUB1.1 R73_USB_HUB1.2 U9_USB_HUB1.4)
rst_hub2: Mother_board_main (R25.1), USB_HUB2 (R72_USB_HUB2.1 R73_USB_HUB2.2 U9_USB_HUB2.4)
rst_hub3: Mother_board_main (R26.1), USB_HUB3 (R72_USB_HUB3.1 R73_USB_HUB3.2 U9_USB_HUB3.4)
rst_hub_0: Mother_board_main (R21.1), USB_HUB (R72_USB_HUB.1 R73_USB_HUB.2 U9_USB_HUB.4)